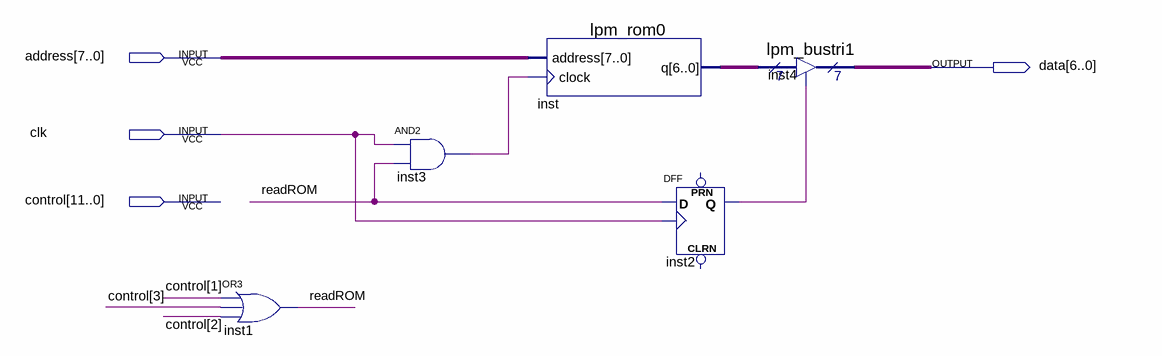
[diagram p0: schematic sheet]
// Quartus schematic ROM.bdf as structural Verilog: 5 symbols, 4 pins
module ROM (
  input  [7:0] address,
  input  clk,
  input  [11:0] control,
  output [6:0] data
);

  wire inst2_q, inst3_out, readROM;
  wire [6:0] inst_q;

  or inst1 (readROM, control[1], control[3], control[2]);
  and inst3 (inst3_out, clk, readROM);
  lpm_rom0 inst (.address(address), .clock(inst3_out), .q(inst_q));
  DFF inst2 (.CLK(clk), .D(readROM), .Q(inst2_q));  // open: CLRN, PRN
  lpm_bustri1 inst4 (.enabledt(inst2_q), .data(inst_q), .tridata(data));
endmodule
